# Altium project STM32F446RE_Board.PrjPcb
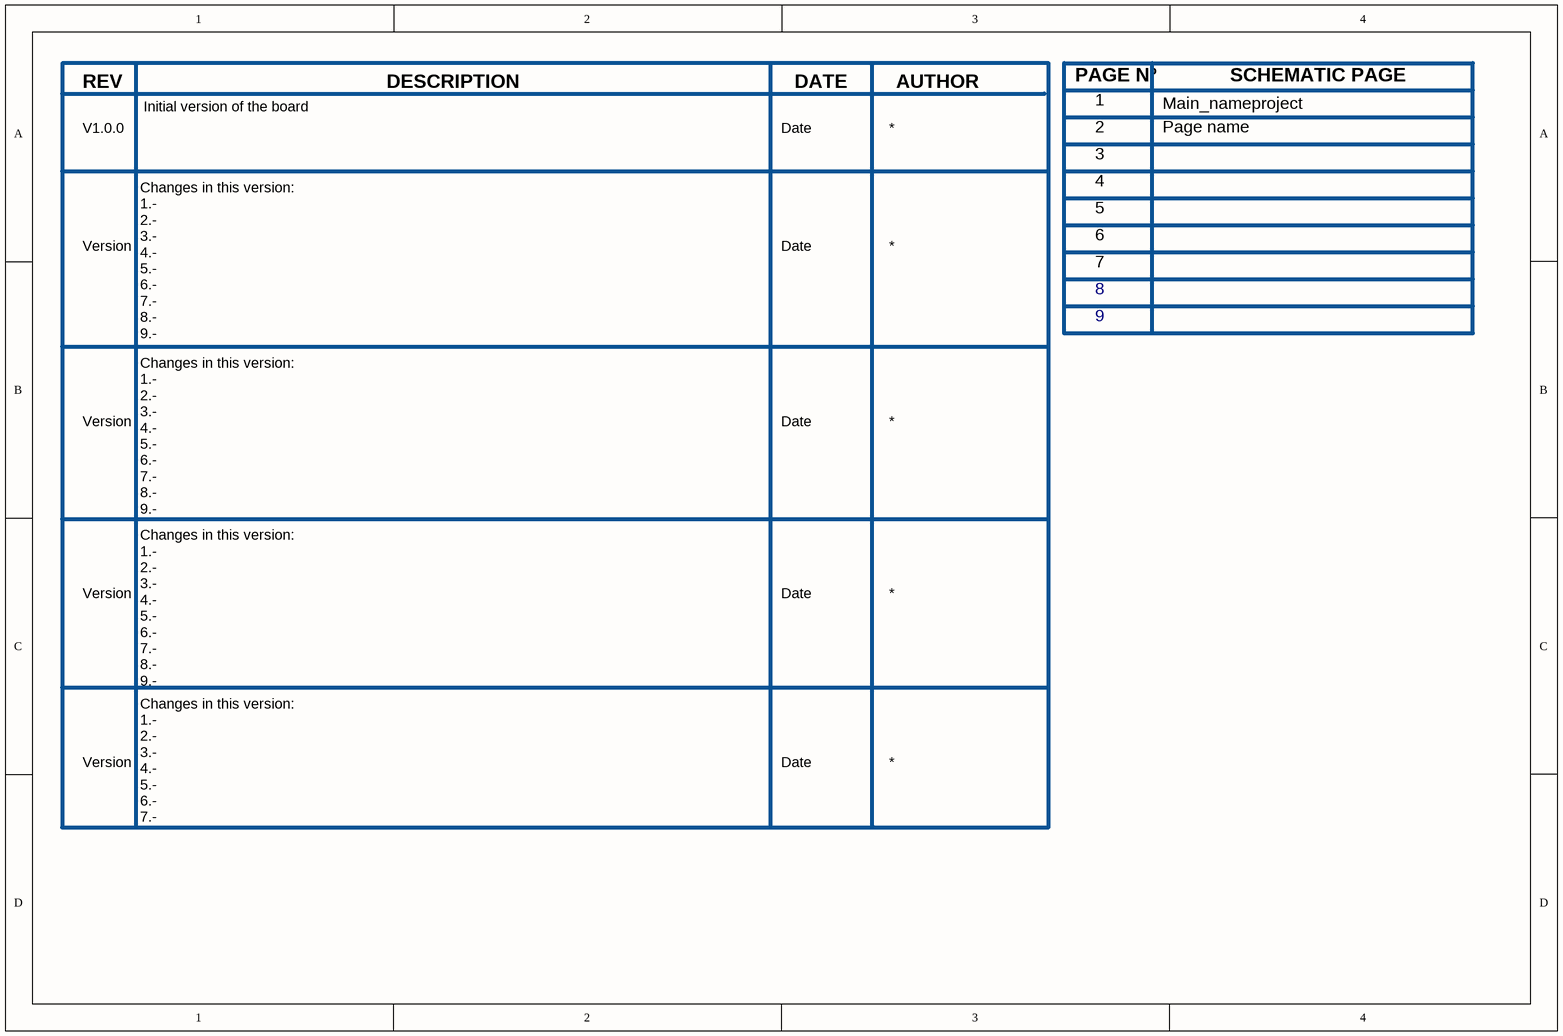
[diagram p0: Main.SchDoc]
4 sheets, 1 parts. Net scope: global (net labels, ports and power ports of the same name join across sheets).
Board file: STM32F446RE_PCB.PcbDoc
Sheets:
  Main.SchDoc
  Power.SchDoc
  STM32F446RE.SchDoc
  Headers.SchDoc

## Sheet Main.SchDoc
size A4; DocumentNumber: 1; SheetNumber: 1; SheetTotal: 6

### Notes on the sheet
- REV
- DESCRIPTION
- DATE
- AUTHOR
- PAGE Nº
- 1
- Main_nameproject
- SCHEMATIC PAGE
- V1.0.0
- Initial version of the board
- Date
- 2
- 3
- Page name
- 4
- 5
- 6
- Version
- 7
- 8
- Changes in this version:
  1.-
  2.-
  3.-
  4.-
  5.-
  6.-
  7.-
  8.-
  9.-
- 9

## Sheet Power.SchDoc
size A4; DocumentNumber: 5; SheetNumber: 5; SheetTotal: 6

## Sheet STM32F446RE.SchDoc
size A4; DocumentNumber: 2; SheetNumber: 2; SheetTotal: 6

### Notes on the sheet
- Project:
- Date:
- Page Content:
- Variant:
- PageSize:
- FW Version:
- Drawn by:
- SW Version:
- Checked by:
- MECH Version:
- Sheet
- Revision:
- of

## Sheet Headers.SchDoc
size A4; DocumentNumber: 6; SheetNumber: 6; SheetTotal: 6
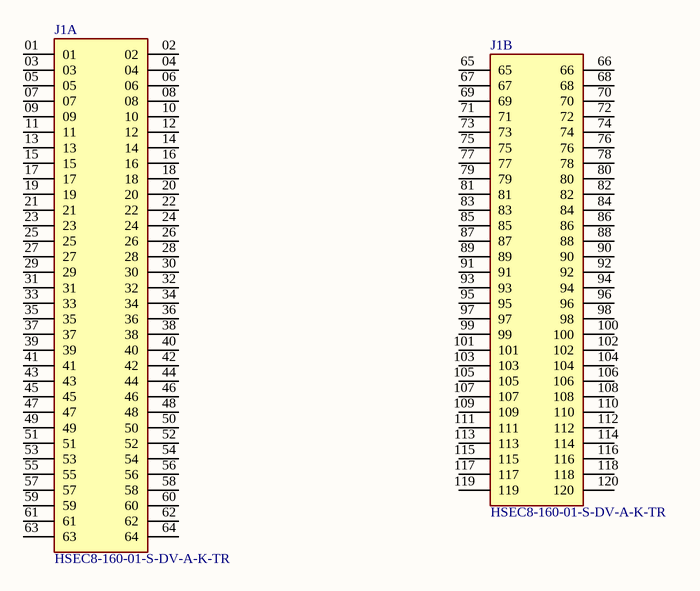
[diagram p1: Headers.SchDoc]

### Parts
J1  HSEC8-160-01-S-DV-A-K-TR  [SAMTEC_HSEC8-160-01-S-DV-A-K-TR]  (parts A,B of 2)

### Nets

Not connected (* = marked no-connect by the designer): J1 01 02 03 04 05 06 07 08 09 10 11 12 13 14 15 16 17 18 19 20 21 22 23 24 25 26 27 28 29 30 31 32 33 34 35 36 37 38 39 40 41 42 43 44 45 46 47 48 49 50 51 52 53 54 55 56 57 58 59 60 61 62 63 64 65 66 67 68 69 70 71 72 73 74 75 76 77 78 79 80 81 82 83 84 85 86 87 88 89 90 91 92 93 94 95 96 97 98 99 100 101 102 103 104 105 106 107 108 109 110 111 112 113 114 115 116 117 118 119 120

### Library data of the parts
J1 = HSEC8-160-01-S-DV-A-K-TR: 0.80 mm High-Speed Edge Card Connector, Vertical; MF: Samtec; Purchase-URL: https://pricing.snapeda.com/search/part/HSEC8-160-01-S-DV-A-K-TR/?ref=eda; Value: *; Check_prices: https://www.snapeda.com/parts/HSEC8-160-01-S-DV-A-K-TR/Samtec/view-part/?ref=eda; SnapEDA_Link: https://www.snapeda.com/parts/HSEC8-160-01-S-DV-A-K-TR/Samtec/view-part/?ref=snap; Package: None; Availability: In Stock; Price: None; MP: HSEC8-160-01-S-DV-A-K-TR